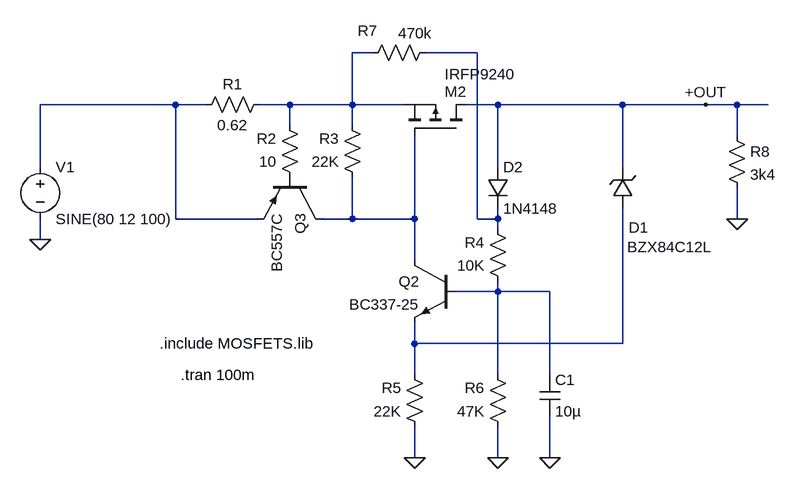
[diagram p0: schematic HV_Reg_Positive.asc]
HV_Reg_Positive.asc, the LTspice schematic file:
Version 4
SHEET 1 3884 2196
WIRE 3248 1552 3216 1552
WIRE 3408 1552 3328 1552
WIRE 2944 1632 2736 1632
WIRE 2992 1632 2944 1632
WIRE 3120 1632 3072 1632
WIRE 3216 1632 3216 1552
WIRE 3216 1632 3120 1632
WIRE 3296 1632 3216 1632
WIRE 3440 1632 3392 1632
WIRE 3632 1632 3440 1632
WIRE 3760 1632 3632 1632
WIRE 3808 1632 3760 1632
WIRE 3856 1632 3808 1632
WIRE 3120 1664 3120 1632
WIRE 3216 1664 3216 1632
WIRE 3808 1680 3808 1632
WIRE 2736 1728 2736 1632
WIRE 3440 1728 3440 1632
WIRE 3632 1728 3632 1632
WIRE 2944 1808 2944 1632
WIRE 3072 1808 2944 1808
WIRE 3216 1808 3216 1744
WIRE 3216 1808 3168 1808
WIRE 3312 1808 3312 1680
WIRE 3312 1808 3216 1808
WIRE 3408 1808 3408 1552
WIRE 3440 1808 3440 1792
WIRE 3440 1808 3408 1808
WIRE 3808 1808 3808 1760
WIRE 3440 1824 3440 1808
WIRE 2736 1840 2736 1808
WIRE 3312 1872 3312 1808
WIRE 3440 1920 3440 1904
WIRE 3440 1920 3376 1920
WIRE 3520 1920 3440 1920
WIRE 3312 2000 3312 1968
WIRE 3632 2000 3632 1792
WIRE 3632 2000 3312 2000
WIRE 3312 2048 3312 2000
WIRE 3440 2048 3440 1920
WIRE 3520 2048 3520 1920
WIRE 3312 2176 3312 2128
WIRE 3440 2176 3440 2128
WIRE 3520 2176 3520 2112
FLAG 3312 2176 0
FLAG 3440 2176 0
FLAG 3760 1632 +OUT
FLAG 3520 2176 0
FLAG 3808 1808 0
FLAG 2736 1840 0
SYMBOL zener 3648 1792 R180
WINDOW 0 -24 -29 Left 2
WINDOW 3 -122 -59 Left 2
SYMATTR InstName D1
SYMATTR Value BZX84C12L
SYMATTR Description Diode
SYMATTR Type diode
SYMBOL diode 3424 1728 R0
SYMATTR InstName D2
SYMATTR Value 1N4148
SYMBOL res 3088 1616 R90
WINDOW 0 0 56 VBottom 2
WINDOW 3 32 56 VTop 2
SYMATTR InstName R1
SYMATTR Value 0.62
SYMBOL res 3136 1760 R180
WINDOW 0 36 76 Left 2
WINDOW 3 36 40 Left 2
SYMATTR InstName R2
SYMATTR Value 10
SYMBOL res 3232 1760 R180
WINDOW 0 36 76 Left 2
WINDOW 3 36 40 Left 2
SYMATTR InstName R3
SYMATTR Value 22K
SYMBOL res 3456 1920 R180
WINDOW 0 36 76 Left 2
WINDOW 3 36 40 Left 2
SYMATTR InstName R4
SYMATTR Value 10K
SYMBOL res 3328 2144 R180
WINDOW 0 36 76 Left 2
WINDOW 3 36 40 Left 2
SYMATTR InstName R5
SYMATTR Value 22K
SYMBOL res 3456 2144 R180
WINDOW 0 36 76 Left 2
WINDOW 3 36 40 Left 2
SYMATTR InstName R6
SYMATTR Value 47K
SYMBOL cap 3504 2048 R0
SYMATTR InstName C1
SYMATTR Value 10µ
SYMBOL res 3232 1568 R270
WINDOW 0 34 8 VTop 2
WINDOW 3 62 81 VBottom 2
SYMATTR InstName R7
SYMATTR Value 470k
SYMBOL res 3792 1664 R0
SYMATTR InstName R8
SYMATTR Value 3k4
SYMBOL voltage 2736 1712 R0
WINDOW 123 0 0 Left 2
WINDOW 39 0 0 Left 2
SYMATTR InstName V1
SYMATTR Value SINE(80 12 100)
SYMBOL pmos 3392 1680 M270
WINDOW 0 68 0 VRight 2
WINDOW 3 95 34 VLeft 2
SYMATTR InstName M2
SYMATTR Value IRFP9240
SYMBOL pnp 3168 1744 R90
SYMATTR InstName Q3
SYMATTR Value BC557C
SYMBOL npn 3376 1872 M0
SYMATTR InstName Q2
SYMATTR Value BC337-25
TEXT 2920 2000 Left 2 !.include MOSFETS.lib
TEXT 2952 2048 Left 2 !.tran 100m

The netlist it stands for:
* HV_Reg_Positive.asc
D1 N006 +OUT BZX84C12L
D2 +OUT N002 1N4148
R1 N001 N003 0.62
R2 P001 N001 10
R3 N004 N001 22K
R4 N005 N002 10K
R5 0 N006 22K
R6 0 N005 47K
C1 N005 0 10µ
R7 N001 N002 470k
R8 +OUT 0 3k4
V1 N003 0 SINE(80 12 100)
M2 +OUT N004 N001 N001 IRFP9240
Q3 N004 P001 N003 0 BC557C
Q2 N004 N005 N006 0 BC337-25
.model D D
.lib standard.dio
.model NPN NPN
.model PNP PNP
.lib standard.bjt
.model NMOS NMOS
.model PMOS PMOS
.lib standard.mos
.include MOSFETS.lib
.tran 100m
.backanno
.end